# Altium schematic sheet Структура.SchDoc
size A3; DocumentNumber: 1; SheetNumber: 1; SheetTotal: 12
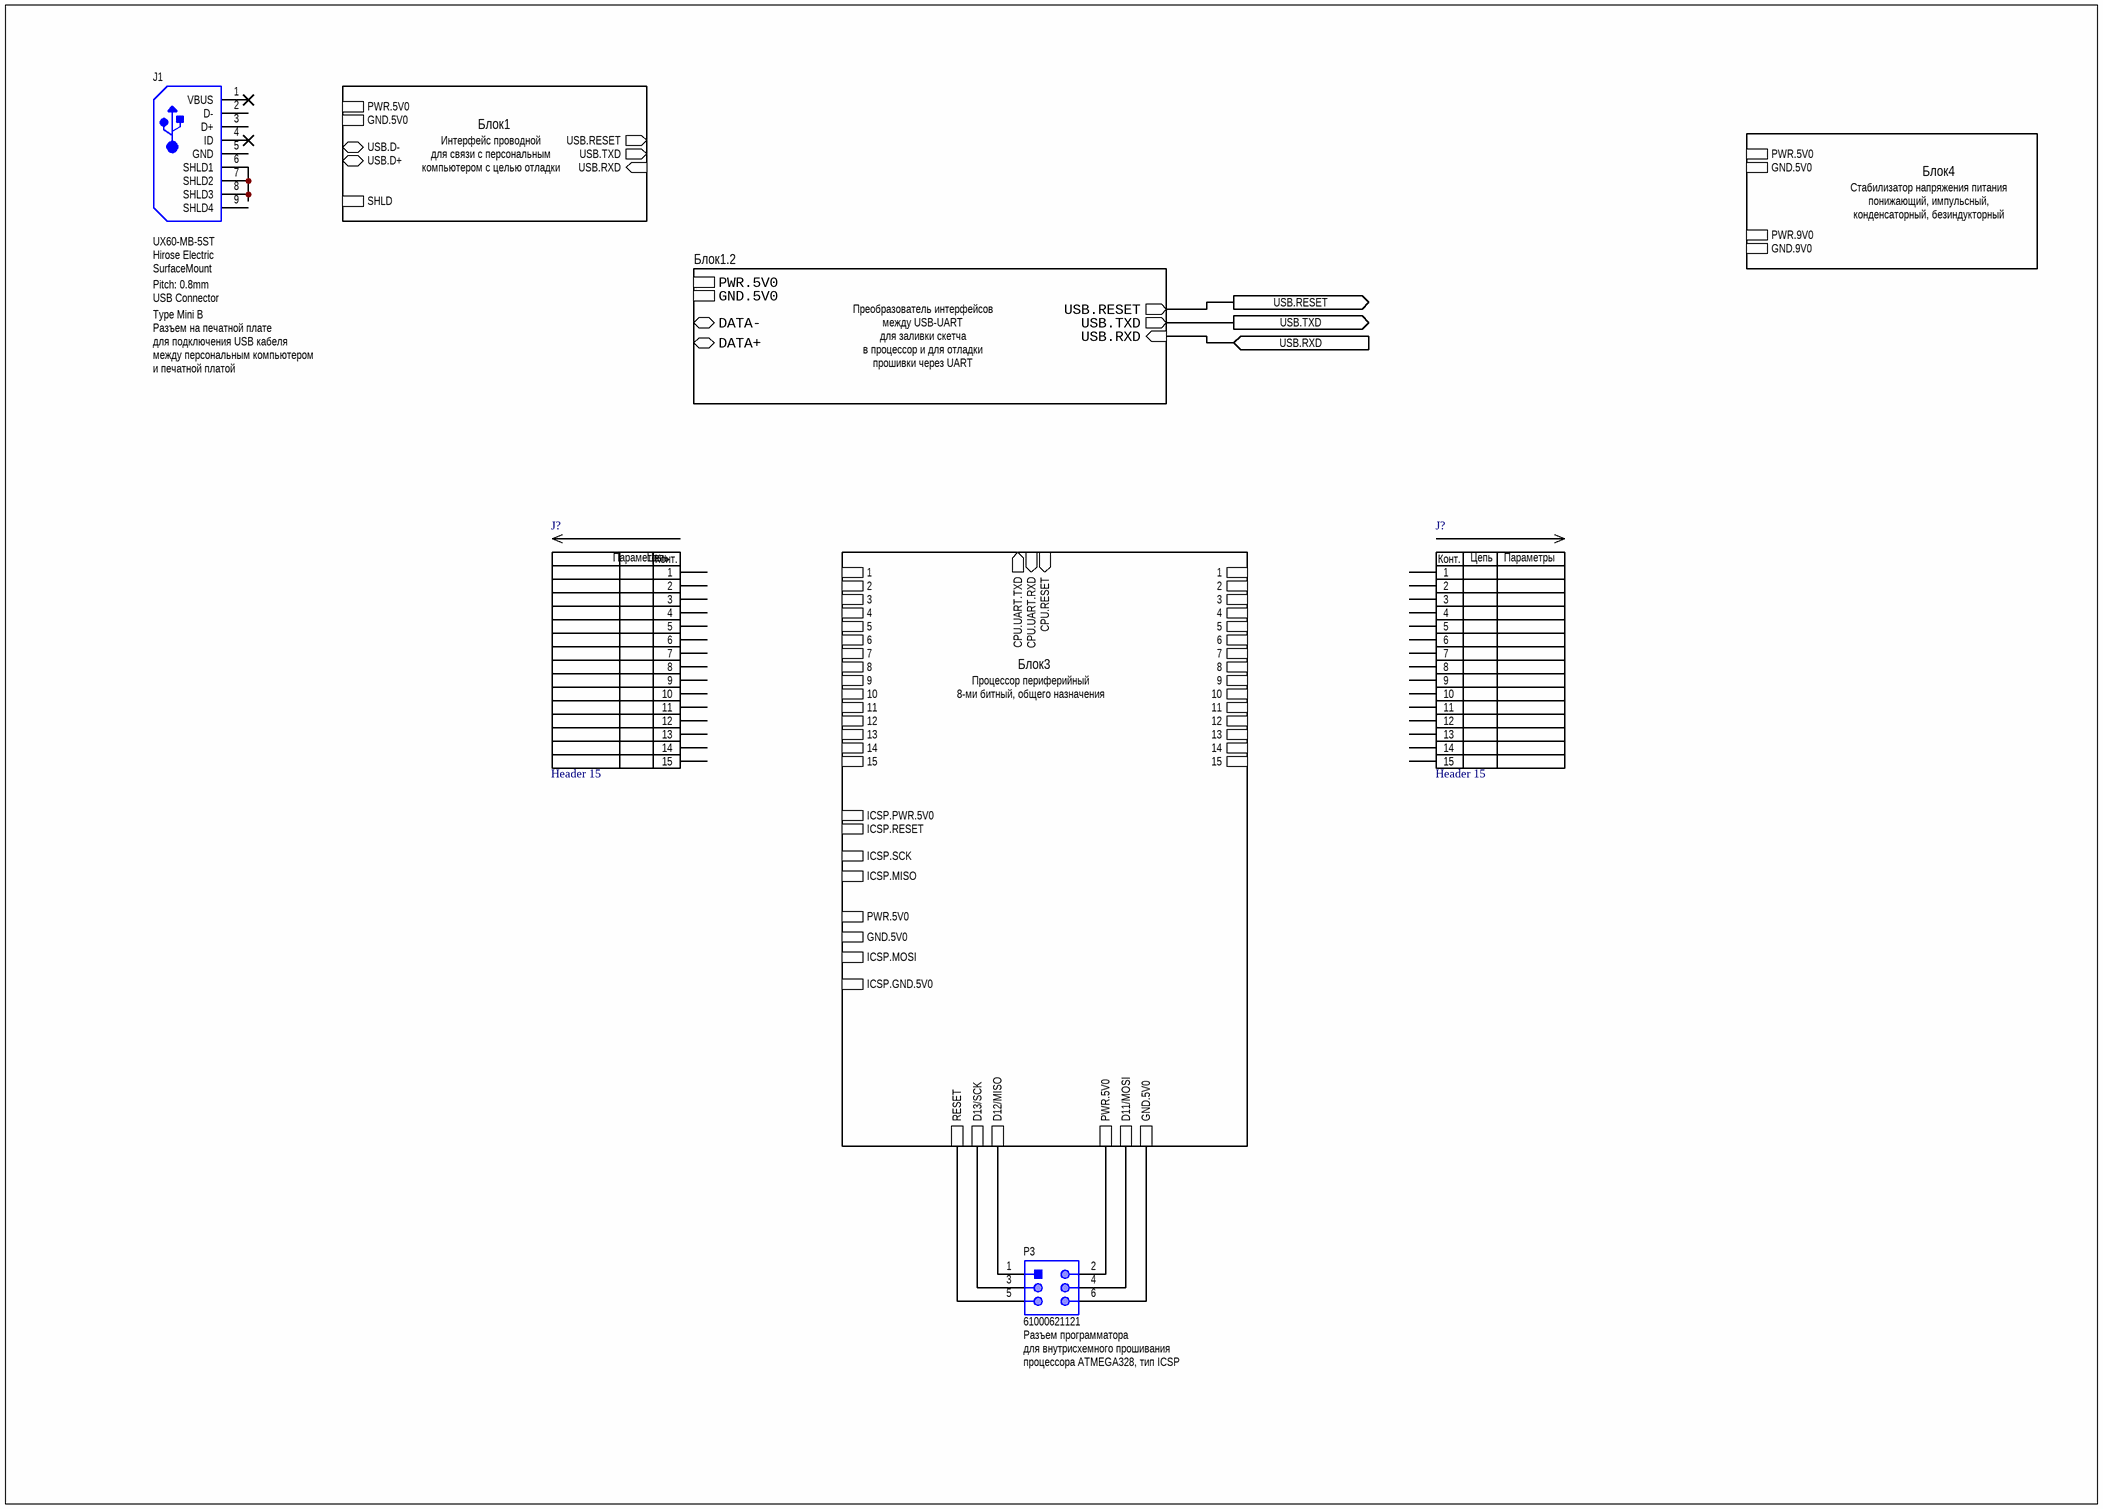
[diagram p0: Структура.SchDoc]

## Parts
(Parts that share a designator on the sheet are numbered #1, #2 ... from top to bottom, then left to right.)
J1  UX60-MB-5ST  Manufacturer: Hirose Electric  Termination: SurfaceMount  Pitch: 0.8mm  Parameter 1: USB Connector  Parameter 2: Type Mini B  Parameter 3: Разъем на печатной плате  Parameter 4: для подключения USB кабеля  Parameter 5: между персональным компьютером  Parameter 6: и печатной платой  [HIRO-UX60-MB-5ST_V]
J?#1  Header 15  [HDR1X15]
J?#2  Header 15  [HDR1X15]
P3  61000621121  Parameter 1: Разъем программатора  Parameter 2: для внутрисхемного прошивания  Parameter 3: процессора ATMEGA328, тип ICSP  [61000621121]

## Sub-sheets
Блок1 = Блок1.SchDoc: USB.RXD (in), USB.TXD (out), USB.RESET (out), GND.5V0, PWR.5V0, USB.D- (bidir), USB.D+ (bidir), SHLD  | Parameter 1: Интерфейс проводной; Parameter 2: для связи с персональным; Parameter 3: компьютером с целью отладки
Блок1.2 = Блок1.2.SchDoc: USB.TXD (out), DATA- (bidir), DATA+ (bidir), USB.RXD (in), USB.RESET (out), PWR.5V0, GND.5V0  | Parameter 1: между USB-UART; Parameter 2: для заливки скетча; Parameter 3: в процессор и для отладки; Parameter 4: Преобразователь интерфейсов; Parameter 5: прошивки через UART
Блок3 = Блок3.SchDoc: CPU.UART.TXD (out), CPU.UART.RXD (in), CPU.RESET (in), PWR.5V0, GND.5V0, ICSP.MISO, ICSP.SCK, ICSP.RESET, ICSP.PWR.5V0, ICSP.MOSI, ICSP.GND.5V0, 1, 2, 3, 4, 5, 6, 7, 8, 9, 10, 11, 12, 13, 14, 15, 1, 2, 3, 4, 5, 6, 7, 8, 9, 10, 11, 12, 13, 14, 15, D12/MISO, PWR.5V0, D11/MOSI, GND.5V0, D13/SCK, RESET  | Parameter 1: Процессор периферийный; Parameter 2: 8-ми битный, общего назначения; Parameter 3: для настройки индикации, запоминания числа, отправки информации
Блок4 = Блок4.SchDoc: GND.9V0, PWR.5V0, PWR.9V0, GND.5V0  | Parameter 1: Стабилизатор напряжения питания; Parameter 2: понижающий, импульсный,; Parameter 3: конденсаторный, безиндукторный

## Ports
USB.RESET (out), USB.RXD (in), USB.TXD (out)

## Nets
USB.RESET: port USB.RESET, sheet Блок1.2/USB.RESET
USB.RXD: port USB.RXD, sheet Блок1.2/USB.RXD
USB.TXD: port USB.TXD, sheet Блок1.2/USB.TXD
NetJ1_6: J1.6(SHLD1) J1.7(SHLD2) J1.8(SHLD3)
NetP3_1: P3.1 ; sheet Блок3/D12/MISO
NetP3_2: P3.2 ; sheet Блок3/PWR.5V0
NetP3_3: P3.3 ; sheet Блок3/D13/SCK
NetP3_4: P3.4 ; sheet Блок3/D11/MOSI
NetP3_5: P3.5 ; sheet Блок3/RESET
NetP3_6: P3.6 ; sheet Блок3/GND.5V0

Not connected (* = marked no-connect by the designer): J1 1(VBUS)* 2(D-) 3(D+) 4(ID)* 5(GND) 9(SHLD4); J?#1 1 2 3 4 5 6 7 8 9 10 11 12 13 14 15; J?#2 1 2 3 4 5 6 7 8 9 10 11 12 13 14 15

## Notes on the sheet
- (in symbol Header 15) Конт.; Параметры; Цепь

## Library data of the parts
J1 = CMP-2000-07375-1: USB Connector Mini B Type, 1 A, 5 V AC, -30 to 75 degC, 5-Pin SMD, RoHS, Tape and Reel; No of Positions: 5; Style/Orientation: RightAngleSocket/Receptacle; Datasheet Version: 04/2008; Datasheet URL: http://datasheet.octopart.com/UX60-MB-5ST-Hirose-datasheet-8329595.pdf; Type: WiretoBoard; Package Reference: UX60-MB-5ST; Manufacturer URL: https://www.hirose.com; Mounting Technology: SurfaceMount; Package Description: 5-Pin Surface Mount Device, Body 7.7 x 9 mm, Pitch 0.8 mm
J?#1 J?#2 = Header 15: Header, 15-Pin; LatestRevisionDate: 17-Jul-2002; LatestRevisionNote: Re-released for DXP Platform.; Publisher: Altium Limited
P3 = CMP-1502-01024-1: SMT Vertical Pin Header WR-PHD, Pitch 2.54 mm, Dual Row, 6 pins; Manufacturer: Wurth Elektronik; Withstanding Voltage: 500VAC; Contact Resistance: 20mOhm; Working Voltage: 250VAC; Gender: Male; Rated Current: 3A; Pin Number: 6; Pitch: 2.54mm; Part Number: 61000621121; Operating Temperature: -40to125degC; Mounting Technology: SMT; Packaging: Tube; Datasheet URL: https://katalog.we-online.de/em/datasheet/6100xx21121.pdf; Package Reference: 61000621121; Publisher: WurthElektronik; Row Number: Dual; Orientation: Vertical; Manufacturer URL: http://www.we-online.de